# Altium schematic sheet Main.SchDoc: Connectors
size B; DocumentNumber: 1; SheetNumber: 1; SheetTotal: 1
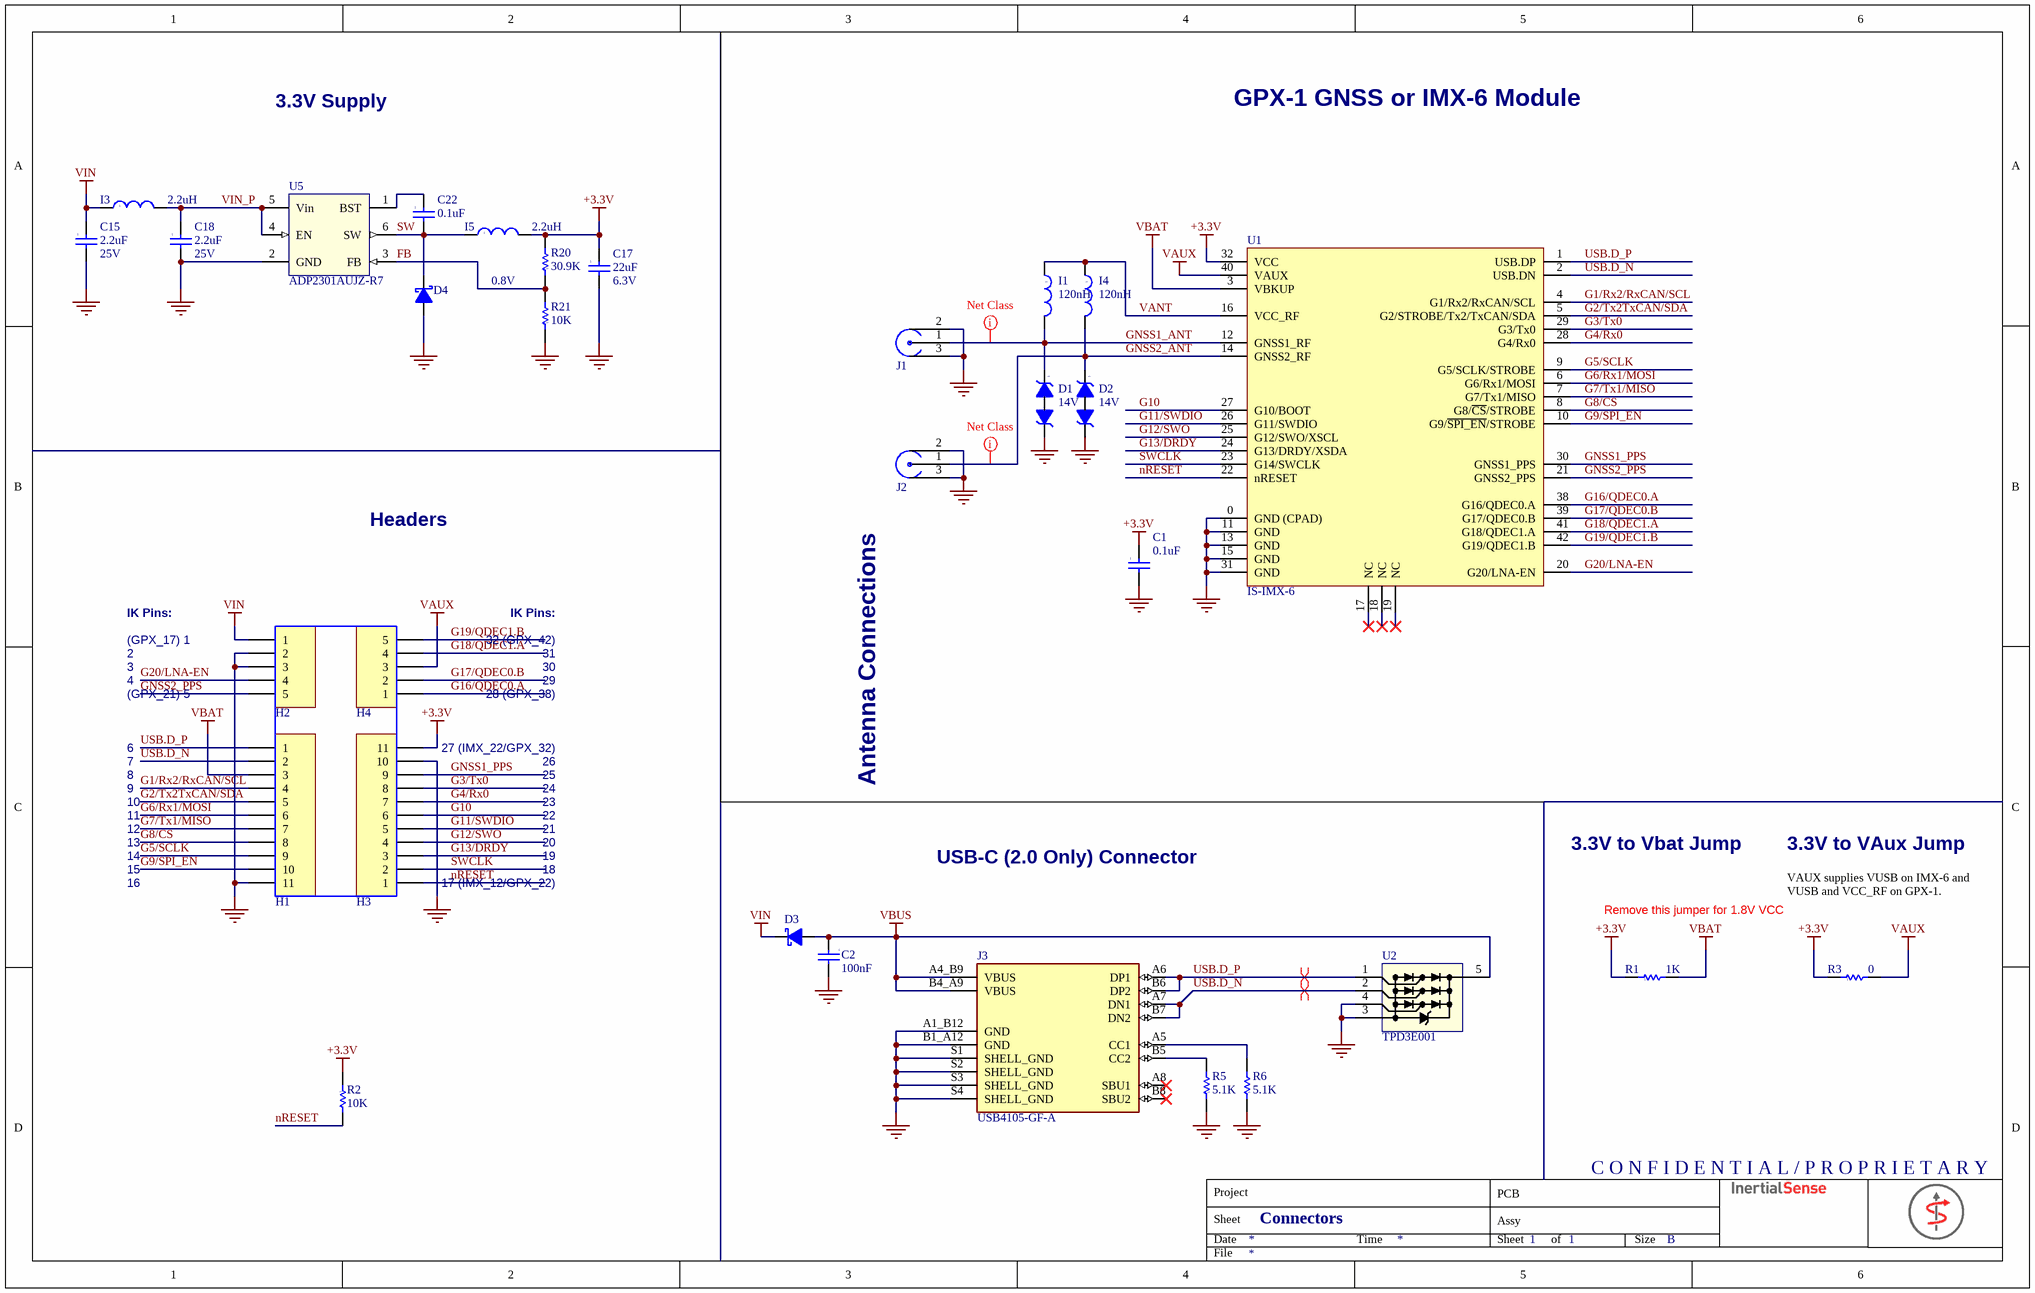
[diagram p0: Main.SchDoc]

## Parts
C1  value 0.1uF  [0402]  (hidden comment: Cap)
C2  value 100nF  [0402]  (hidden comment: Cap)
C15  value 2.2uF  Voltage Rating: 25V  [0603]  (hidden comment: Cap)
C17  value 22uF  Voltage Rating: 6.3V  [0603]  (hidden comment: Cap)
C18  value 2.2uF  Voltage Rating: 25V  [0603]  (hidden comment: Cap)
C22  value 0.1uF  [0402]  (hidden comment: Cap)
D1  Working Voltage: 14V  [R0402]  (hidden comment: Diode - Bidirectional Zener)
D2  Working Voltage: 14V  [R0402]  (hidden comment: Diode - Bidirectional Zener)
D3  Diode - Schottky  [D0603B]  (value not drawn)
D4  Diode - Schottky  [D0603B]  (value not drawn)
H1  Hdr - 11pin  [Header-.1IN-1x11]  (value not drawn)
H2  Hdr - 5pin  [Header-.1IN-1x5]  (value not drawn)
H3  Hdr - 11pin  [Header-.1IN-1x11]  (value not drawn)
H4  Hdr - 5pin  [Header-.1IN-1x5]  (value not drawn)
I1  value 120nH  [0402]  (hidden comment: Inductor)
I3  value 2.2uH  [0806]  (hidden comment: Inductor)
I4  value 120nH  [0402]  (hidden comment: Inductor)
I5  value 2.2uH  [0806]  (hidden comment: Inductor)
J1  RF - GND x 2  [RF UMC SMD]  (value not drawn)
J2  RF - GND x 2  [RF UMC SMD]  (value not drawn)
J3  USB4105-GF-A  [GCT_USB4105-GF-A]
R1  value 1K  [R0402]  (hidden comment: Res)
R2  value 10K  [R0402]  (hidden comment: Res)
R3  value 0  [R0402]  (hidden comment: Res)
R5  value 5.1K  [R0402]  (hidden comment: Res)
R6  value 5.1K  [R0402]  (hidden comment: Res)
R20  value 30.9K  [R0402]  (hidden comment: Res)
R21  value 10K  [R0402]  (hidden comment: Res)
U1  Manufacturer Part Number: IS-IMX-6  [IS-GPX-1.0]  (hidden comment: IMX)
U2  TPD3E001  [SOTFL50P160X60-5N]
U5  Manufacturer Part Number: ADP2301AUJZ-R7  [MO-178-AB]  (hidden comment: ADP2301)

## Nets
+3.3V: C1.1 C17.1 H3.11 I5.2 R1.1 R2.1 R3.1 R20.2 U1.32(VCC)
GND: C1.2 C2.2 C15.2 C17.2 C18.2 D1.2 D2.2 D4.A H1.11 H2.2 H2.3 H3.10 J1.2 J1.3 J2.2 J2.3 J3.A1_B12(GND) J3.B1_A12(GND) J3.S1(SHELL_GND) J3.S2(SHELL_GND) J3.S3(SHELL_GND) J3.S4(SHELL_GND) R5.1 R6.1 R21.1 U1.0(GND_(CPAD)) U1.11(GND) U1.13(GND) U1.15(GND) U1.31(GND) U2.3 U2.4(nc) U5.2(GND)
VAUX: H4.3 R3.2 U1.40(VAUX)
VBAT: H1.3 R1.2 U1.3(VBKUP)
VBUS: C2.1 D3.A J3.A4_B9(VBUS) J3.B4_A9(VBUS) U2.5(nc)
VIN: C15.1 D3.C H2.1 I3.1
FB: R20.1 R21.2 U5.3(FB)
G1/Rx2/RxCAN/SCL: H1.4 U1.4(G1/Rx2/RxCAN/SCL)
G2/Tx2TxCAN/SDA: H1.5 U1.5(G2/STROBE/Tx2/TxCAN/SDA)
G3/Tx0: H3.8 U1.29(G3/Tx0)
G4/Rx0: H3.7 U1.28(G4/Rx0)
G5/SCLK: H1.9 U1.9(G5/SCLK/STROBE)
G6/Rx1/MOSI: H1.6 U1.6(G6/Rx1/MOSI)
G7/Tx1/MISO: H1.7 U1.7(G7/Tx1/MISO)
G8/~{CS}: H1.8 U1.8(G8/~{CS}/STROBE)
G9/~{SPI_EN}: H1.10 U1.10(G9/~{SPI_EN}/STROBE)
G10: H3.6 U1.27(G10/BOOT)
G11/SWDIO: H3.5 U1.26(G11/SWDIO)
G12/SWO: H3.4 U1.25(G12/SWO/XSCL)
G13/DRDY: H3.3 U1.24(G13/DRDY/XSDA)
G16/QDEC0.A: H4.1 U1.38(G16/QDEC0.A)
G17/QDEC0.B: H4.2 U1.39(G17/QDEC0.B)
G18/QDEC1.A: H4.4 U1.41(G18/QDEC1.A)
G19/QDEC1.B: H4.5 U1.42(G19/QDEC1.B)
G20/LNA-EN: H2.4 U1.20(G20/LNA-EN)
GNSS1_ANT: D1.1 I1.2 J1.1 U1.12(GNSS1_RF)
GNSS1_PPS: H3.9 U1.30(GNSS1_PPS)
GNSS2_ANT: D2.1 I4.2 J2.1 U1.14(GNSS2_RF)
GNSS2_PPS: H2.5 U1.21(GNSS2_PPS)
nRESET: H3.1 R2.2 U1.22(nRESET)
SW: C22.2 D4.C I5.1 U5.6(SW)
SWCLK: H3.2 U1.23(G14/SWCLK)
USB.D_N: H1.2 J3.A7(DN1) J3.B7(DN2) U1.2(USB.DN) U2.2
USB.D_P: H1.1 J3.A6(DP1) J3.B6(DP2) U1.1(USB.DP) U2.1
VANT: I1.1 I4.1 U1.16(VCC_RF)
VIN_P: C18.1 I3.2 U5.4(EN) U5.5(Vin)
NetC22_1: C22.1 U5.1(BST)
NetJ3_A5: J3.A5(CC1) R6.2
NetJ3_B5: J3.B5(CC2) R5.2

Not connected (* = marked no-connect by the designer): J3 A8(SBU1)* B8(SBU2)*; U1 17(NC)* 18(NC)* 19(NC)*

## Layout directives
net class RF_GPS: GNSS1_ANT, GNSS2_ANT
differential pair; net class IMX_USB: USB.D_N, USB.D_P

## Notes on the sheet
- 3.3V Supply
- GPX-1 GNSS or IMX-6 Module
- 0.8V
- Headers
- Antenna Connections
- (GPX_17) 1
- IK Pins:
- 32 (GPX_42)
- (GPX_21) 5
- 2
- 3
- 4
- 28 (GPX_38)
- 29
- 30
- 31
- 6
- 7
- 8
- 27 (IMX_22/GPX_32)
- 25
- 26
- 9
- 10
- 11
- 12
- 13
- 20
- 21
- 22
- 23
- 24
- 14
- 15
- 16
- 17 (IMX_12/GPX_22)
- 18
- 19
- USB-C (2.0 Only) Connector
- 3.3V to Vbat Jump
- Remove this jumper for 1.8V VCC
- 3.3V to VAux Jump
- VAUX supplies VUSB on IMX-6 and VUSB and VCC_RF on GPX-1.
- C O N F I D E N T I A L / P R O P R I E T A R Y
- Date
- Sheet
- Project
- Time
- PCB
- Assy
- of
- Size
- B
- File

## Library data of the parts
C1 C2 = Cap: CAP CER .10UF 50V X7R 10% 0402; Manufacturer: TDK Corporation; Manufacturer Part Number: C1005X7R1H104K; Capacitance: 0.1µF; Published: 8-Jun-2000; LatestRevisionDate: 17-Jul-2002; LatestRevisionNote: Re-released for DXP Platform.; Publisher: Altium Limited; Category: Capacitors; Supplier 1: Digi-Key; Supplier Part Number 1: 445-5932-1-ND; RoHS: RoHS Compliant; Stock 1: 174080; Pricing 1: 1=0.3, 10=0.2, 100=0.08, 250=0.05752, 500=0.041, 1000=0.03 (USD); Voltage - Rated: 50V; Tolerance: ±10%; Temperature Coefficient: X7R; Mounting Type: Surface Mount, MLCC; Operating Temperature: -55°C ~ 125°C; Applications: General Purpose; Ratings: -; Package / Case: 0402 (1005 Metric); Size / Dimension: 0.039" L x 0.020" W (1.00mm x 0.50mm); Height: -; Thickness: 0.022" (0.55mm); Lead Spacing: -; Features: -; Packaging: Cut Tape (CT); Lead Style: -; ComponentLink1URL: http://www.tdk.co.jp/tefe02/e412_c.pdf; ComponentLink1Description: http://www.tdk.co.jp/tefe02/e412_c.pdf
C15 C18 = Cap: CAP CER 2.2UF 25V X6S 0603; Manufacturer: Murata; Manufacturer Part Number: GRT188C81E225KE13D; Tolerance: 10%; Published: 8-Jun-2000; LatestRevisionDate: 17-Jul-2002; LatestRevisionNote: Re-released for DXP Platform.; Publisher: Altium Limited; Category: Capacitors; Supplier 1: Digi-Key; Supplier Part Number 1: 490-12293-6-ND; Stock 1: 16854; Pricing 1: 1=0.35, 10=0.239, 100=0.1355, 500=0.09564, 1000=0.08369 (USD); Mount: Surface Mount; Case/Package: 0603; Case Code (Metric): 1608; Case Code (Imperial): 0603; Min Operating Temperature: -55°C; Max Operating Temperature: 105°C; Packaging: Tape and Reel; Capacitance: 2.2uF; Dielectric: X6S; Voltage Rating (DC): 25V; Length: 0.063inch; Width: 0.031inch; Thickness: 0.035inch; ComponentLink1URL: http://www.farnell.com/datasheets/2165949.pdf; ComponentLink1Description: http://www.farnell.com/datasheets/2165949.pdf; ComponentLink2URL: http://search.murata.co.jp/Ceramy/image/img/A01X/G101/ENG/GRT188C81E225KE13-01.pdf; ComponentLink2Description: http://search.murata.co.jp/Ceramy/image/img/A01X/G101/ENG/GRT188C81E225KE13-01.pdf
C17 = Cap: CAP CER 22UF 6.3V X6S 0603; Manufacturer: Murata; Manufacturer Part Number: GRM188C80J226ME15D; Tolerance: 20%; Published: 8-Jun-2000; LatestRevisionDate: 17-Jul-2002; LatestRevisionNote: Re-released for DXP Platform.; Publisher: Altium Limited; Category: Capacitors; Supplier 1: Digi-Key; Supplier Part Number 1: 490-10471-6-ND; Stock 1: 0; Pricing 1: 1=0.25, 10=0.168, 100=0.0955, 500=0.0674, 1000=0.05897 (USD); Mount: Surface Mount; Case/Package: 0603; Weight: 0.000222oz; Case Code (Metric): 1608; Case Code (Imperial): 0603; Min Operating Temperature: -55°C; Max Operating Temperature: 105°C; Capacitance: 22uF; Packaging: Tape and Reel; Dielectric: X6S; Termination: SMD/SMT; Voltage Rating (DC): 6.3V; Package Quantity: 4000; Length: 0.063inch; Height: 0.8mm; Width: 0.8mm; Thickness: 0.039inch; Lead Free: Lead Free; ComponentLink1URL: http://www.mouser.com/ds/2/281/c02e-2905.pdf; ComponentLink1Description: http://www.mouser.com/ds/2/281/c02e-2905.pdf; ComponentLink2URL: http://search.murata.co.jp/Ceramy/image/img/A01X/partnumbering_e_01.pdf; ComponentLink2Description: http://search.murata.co.jp/Ceramy/image/img/A01X/partnumbering_e_01.pdf
C22 = Cap: CAP CER 0.1UF 50V X7R 0402; Manufacturer: TDK; Manufacturer Part Number: CGA2B3X7R1H104K050BB; Tolerance: 10%; Published: 8-Jun-2000; LatestRevisionDate: 17-Jul-2002; LatestRevisionNote: Re-released for DXP Platform.; Publisher: Altium Limited; Category: Capacitors; Supplier 1: Digi-Key; Supplier Part Number 1: 445-6899-1-ND; Stock 1: 12402793; Pricing 1: 1=0.16000, 10=0.11700, 100=0.05500, 500=0.03858, 1000=0.03194, 2500=0.02973, 5000=0.02720 (USD); RoHS: Yes; Mount: Surface Mount; Case/Package: 0402; Weight: 2.3E-05oz; Case Code (Metric): 1005; Case Code (Imperial): 0402; Min Operating Temperature: -55°C; Max Operating Temperature: 125°C; Voltage Rating: 50V; Capacitance: 0.1uF; Packaging: Tape and Reel; Voltage Rating (DC): 50V; Dielectric: X7R; Termination: SMD/SMT; Package Quantity: 1; Composition: Ceramic; Voltage: 50V; Length: 1mm; Height: 0.5mm; Depth: 0.5mm; Width: 0.02inch; Thickness: 0.022inch; Ratings: AEC-Q200; Lead Free: Lead Free; REACH SVHC: No SVHC; ComponentLink1URL: https://datasheet.ciiva.com/16498/mlccspec-automotive-general-midvoltage-en-16498528.pdf?src-supplier=Future+Electronics; ComponentLink1Description: https://datasheet.ciiva.com/16498/mlccspec-automotive-general-midvoltage-en-16498528.pdf?src-supplier=Future+Electronics; ComponentLink2URL: https://datasheet.ciiva.com/24216/cga2b3x7r1h104k050bb-266281-24216070.pdf?src-supplier=Mouser; ComponentLink2Description: https://datasheet.ciiva.com/24216/cga2b3x7r1h104k050bb-266281-24216070.pdf?src-supplier=Mouser; ComponentLink3URL: https://datasheet.ciiva.com/7975/1788388-7975306.pdf?src-supplier=Element14; ComponentLink3Description: https://datasheet.ciiva.com/7975/1788388-7975306.pdf?src-supplier=Element14; ComponentLink4URL: https://datasheet.ciiva.com/22703/1807242-22703013.pdf?src-supplier=Element14; ComponentLink4Description: https://datasheet.ciiva.com/22703/1807242-22703013.pdf?src-supplier=Element14; ComponentLink5URL: https://datasheet.ciiva.com/22725/1735392-22725627.pdf?src-supplier=Element14; ComponentLink5Description: https://datasheet.ciiva.com/22725/1735392-22725627.pdf?src-supplier=Element14
D1 D2 = Diode - Bidirectional Zener: LITTELFUSE - PESD0402-140 - DIODE, ESD PROTECTION, 0402, FULL REEL; Clamping Voltage: 40V; Number of Bidirectional Channels: 1; Power Line Protection: No; Turn-On Delay Time: 1ns; Supplier 1: Digi-Key; Supplier Part Number 1: PESD0402-140CT-ND; Manufacturer: Littelfuse; Manufacturer Part Number: PESD0402-140; RoHS: No; Category: TVS Diodes; Stock 1: 211482; Pricing 1: 1=0.40000, 10=0.32100, 100=0.22900, 500=0.17400, 1000=0.13737, 2000=0.13279, 5000=0.12821 (USD); Mount: Surface Mount; Case/Package: 0402; Number of Pins: 2; Min Operating Temperature: -55°C; Max Operating Temperature: 125°C; Packaging: Tape and Reel; Direction: Bidirectional; Reverse Standoff Voltage: 14V; Resistor Type: Zener; Operating Supply Voltage: 14V; Lead Free: Lead Free; REACH SVHC: Unknown; ComponentLink1URL: https://datasheet.ciiva.com/58684/-58684341.pdf?src-supplier=Digi-Key; ComponentLink1Description: https://datasheet.ciiva.com/58684/-58684341.pdf?src-supplier=Digi-Key
D3 D4 = Diode - Schottky: DIODE SCHOTTKY 30V 2A 0603; Manufacturer: Vishay; Manufacturer Part Number: VSKY20301608-G4-08; Supplier 1: Digi-Key; Supplier Part Number 1: VSKY20301608-G4-08GICT-ND; Stock 1: 13064; Pricing 1: 1=0.38, 10=0.305, 25=0.2792, 100=0.2076, 250=0.1882, 500=0.15574, 1000=0.1168, 2500=0.10707 (USD); ComponentLink1URL: http://www.mouser.com/ds/2/427/vsky20301608-777242.pdf; ComponentLink1Description: http://www.mouser.com/ds/2/427/vsky20301608-777242.pdf
H1 H3 = Hdr - 11pin: 11 pin header
H2 H4 = Hdr - 5pin: 5 pin header
I1 I4 = Inductor: Inductor RF Chip Wirewound 120nH 5% 100MHz 20Q-Factor 110mA 2.66Ohm DCR 0402 Paper T/R; Manufacturer: Murata; Manufacturer Part Number: LQW15ANR12J00D; Core Material: Air,Ferrite; DC Resistance (DCR): 2.66R; Shielding: Unshielded; Self Resonant Frequency: 1GHz; ComponentLink1URL: http://search.murata.co.jp/Ceramy/image/img/PDF/ENG/L0075S0083LQG15HS.pdf; ComponentLink1Description: http://search.murata.co.jp/Ceramy/image/img/PDF/ENG/L0075S0083LQG15HS.pdf; Supplier 1: Digi-Key; Supplier Part Number 1: 490-4091-1-ND; RoHS: Yes; Category: Fixed Inductors; Stock 1: 2053; Pricing 1: 1=0.15000, 10=0.13500, 25=0.12000, 50=0.10200, 100=0.09000, 250=0.08252, 500=0.07500, 1000=0.06300, 2500=0.05400 (USD); Mount: Surface Mount; Case/Package: 0402; Number of Pins: 2; Case Code (Imperial): 0402; Weight: 2.8E-05oz; Case Code (Metric): 1005; Min Operating Temperature: -55°C; Max Operating Temperature: 125°C; Tolerance: 5%; Inductance: 120nH; Max DC Current: 110mA; Packaging: Tape and Reel; Inductance Tolerance: 5%; Package Quantity: 10000; Current Rating: 110mA; Test Frequency: 100MHz; Termination: SMD/SMT; DC Current: 110mA; Length: 1mm; Width: 0.02inch; Height: 0.5mm; Depth: 0.6mm; Radiation Hardening: No; Lead Free: Lead Free; Military Standard: Not; REACH SVHC: No SVHC; ComponentLink2URL: https://datasheet.ciiva.com/11799/0900766b8090d800-11799096.pdf?src-supplier=RSComponents; ComponentLink2Description: https://datasheet.ciiva.com/11799/0900766b8090d800-11799096.pdf?src-supplier=RSComponents; ComponentLink3URL: https://datasheet.ciiva.com/1042/l0075s0080lqw15a-00-1042180.pdf?src-supplier=Digi-Key; ComponentLink3Description: https://datasheet.ciiva.com/1042/l0075s0080lqw15a-00-1042180.pdf?src-supplier=Digi-Key; ComponentLink4URL: https://datasheet.ciiva.com/1042/l0075s0080lqw15a-00-1042181.pdf?src-supplier=Digi-Key; ComponentLink4Description: https://datasheet.ciiva.com/1042/l0075s0080lqw15a-00-1042181.pdf?src-supplier=Digi-Key; ComponentLink5URL: https://datasheet.ciiva.com/1042/l0075s0080lqw15a-00-1042182.pdf?src-supplier=Digi-Key; ComponentLink5Description: https://datasheet.ciiva.com/1042/l0075s0080lqw15a-00-1042182.pdf?src-supplier=Digi-Key; ComponentLink6URL: https://datasheet.ciiva.com/16207/l0075s0080lqw15a-00-16207819.pdf?src-supplier=Future+Electronics; ComponentLink6Description: https://datasheet.ciiva.com/16207/l0075s0080lqw15a-00-16207819.pdf?src-supplier=Future+Electronics; ComponentLink7URL: https://datasheet.ciiva.com/8506/l0075s0080lqw15a-00-8506030.pdf?src-supplier=Avnet; ComponentLink7Description: https://datasheet.ciiva.com/8506/l0075s0080lqw15a-00-8506030.pdf?src-supplier=Avnet
I3 I5 = Inductor: FIXED IND 2.2UH 1.2A 110 MOHM; Manufacturer: TDK; Manufacturer Part Number: MLP2016H2R2MT0S1; Core Material: Ferrite; Tolerance: 20%; Shielding: Unshielded; DC Resistance (DCR): 137.5mR; Test Frequency: 2MHz; Supplier 1: Digi-Key; Supplier Part Number 1: 445-15724-6-ND; Stock 1: 14048; Pricing 1: 1=0.38, 10=0.335, 100=0.2302, 500=0.19674, 1000=0.1507 (USD); Mount: Surface Mount; Case/Package: 0806; Case Code (Metric): 2016; Case Code (Imperial): 0806; Min Operating Temperature: -40°C; Max Operating Temperature: 125°C; Package Quantity: 3000; Packaging: Tape and Reel; Current Rating: 1.2A; Inductance: 2.2uh; Length: 0.079inch; Width: 0.063inch; Height - Seated (Max): 0.039inch; Lead Free: Lead Free; ComponentLink1URL: https://datasheet.ciiva.com/29697/inductor-commercial-power-mlp-en-29697725.pdf; ComponentLink1Description: https://datasheet.ciiva.com/29697/inductor-commercial-power-mlp-en-29697725.pdf; ComponentLink2URL: https://datasheet.ciiva.com/29697/inductor-commercial-power-mlp-en-29697726.pdf; ComponentLink2Description: https://datasheet.ciiva.com/29697/inductor-commercial-power-mlp-en-29697726.pdf
J1 J2 = RF - GND x 2: CONN UMC RCPT STR 50 OHM SMD; Manufacturer: Emerson Network Power Connectivity Johnson; Manufacturer Part Number: 128-0711-201; Connector Style: Ultra Miniature Coaxial; Connector Type: Receptacle, Male Pins; Contact Termination: Solder; Impedance: 50 Ohm; Frequency - Max: 6GHz; Body Finish: Gold; Voltage Rating: 200V; Supplier 1: Digi-Key; Supplier Part Number 1: J983CT-ND; RoHS: RoHS Compliant; Category: Connectors, Interconnects; Stock 1: 1514; Pricing 1: 1=0.93, 10=0.832, 50=0.784, 100=0.672, 250=0.576, 500=0.544, 750=0.48, 1000=0.448 (USD); Packaging: Cut Tape (CT); Shield Termination: Solder; Mounting Type: Surface Mount; Cable Group: -; Fastening Type: Snap-On; Features: -; Housing Color: Gold; Ingress Protection: -; Body Material: -; Center Contact Material: -; Center Contact Plating: Gold; Dielectric Material: -; Operating Temperature: -40°C ~ 90°C; ComponentLink1URL: http://media.digikey.com/pdf/Data%20Sheets/Emerson%20PDFs/UMC%20Product%20Catalog.pdf; ComponentLink1Description: http://media.digikey.com/pdf/Data%20Sheets/Emerson%20PDFs/UMC%20Product%20Catalog.pdf
J3 = USB4105-GF-A: USB-C (USB TYPE-C) USB 2.0 Receptacle Connector 24 (16+8 Dummy) Position Surface Mount, Right Angle; Through Hole; Manufacturer: GCT; Value: *; Availability: Unavailable; Price: None; Package: None; Manufacturer Part Number: USB4105-GF-A; Supplier Part Number 1: 2073-USB4105-GF-ACT-ND; Supplier 1: DigiKey
R1 = Res: 1 kOhms 1/16W Chip Resistor 0402 (1005 Metric) Moisture Resistant Thick Film; Manufacturer: Yageo; Manufacturer Part Number: RC0402FR-071KL; Tolerance: 1%; Temperature Coefficient: 100ppm/°C; Power Rating: 62.5mW; Voltage Rating: 50V; Max Power Dissipation: 63mW; Supplier: Digi-Key; Supplier Part Number: 311-1.00KLRTR-ND; RoHS: Yes; Category: Chip SMD Resistors; Stock: 29757748; Pricing: 10000=0.00261, 20000=0.00231, 30000=0.00216, 50000=0.00199, 100000=0.00179 (USD); Case/Package: 0402; Pins: 2; Case Code (Imperial): 0402; Case Code (Metric): 1005; Min Operating Temperature: -55°C; Max Operating Temperature: 155°C; Resistor Type: Thick Film; Packaging: Tape and Reel; Voltage Rating (DC): 50V; Termination: SMD/SMT; Features: Moisture Resistant; Series: RC; Number of Terminations: 2; Resistance Tolerance: 1%; Construction: Rectangular; Technology: THICK FILM; Length: 1mm; Width: 0.5mm; Height: 0.32mm; Depth: 0.5mm; RoHS Compliant: Yes; Reach SVHC Compliant: No; Military Standard: Not; Lead Free: Lead Free; ComponentLink1URL: https://datasheet.ciiva.com/11819/0900766b80c66297-11819477.pdf?src-supplier=Rs; ComponentLink1Description: https://datasheet.ciiva.com/11819/0900766b80c66297-11819477.pdf?src-supplier=Rs; ComponentLink2URL: https://datasheet.ciiva.com/7983/1018594-7983502.pdf?src-supplier=Element14; ComponentLink2Description: https://datasheet.ciiva.com/7983/1018594-7983502.pdf?src-supplier=Element14; ComponentLink3URL: https://datasheet.ciiva.com/22747/1018594-22747513.pdf?src-supplier=Element14; ComponentLink3Description: https://datasheet.ciiva.com/22747/1018594-22747513.pdf?src-supplier=Element14; ComponentLink4URL: https://datasheet.ciiva.com/12666/pyu-rc0402-51-rohs-l-6-r-12666741.pdf?src-supplier=Mouser; ComponentLink4Description: https://datasheet.ciiva.com/12666/pyu-rc0402-51-rohs-l-6-r-12666741.pdf?src-supplier=Mouser; ComponentLink5URL: https://datasheet.ciiva.com/7849/1018594-7849869.pdf?src-supplier=Element14; ComponentLink5Description: https://datasheet.ciiva.com/7849/1018594-7849869.pdf?src-supplier=Element14; ComponentLink6URL: https://datasheet.ciiva.com/7849/1018594-7849871.pdf?src-supplier=Element14; ComponentLink6Description: https://datasheet.ciiva.com/7849/1018594-7849871.pdf?src-supplier=Element14; ComponentLink7URL: https://datasheet.ciiva.com/17063/pyu-rc0402-51-rohs-l-6-r-17063193.pdf?src-supplier=Future+Electronics; ComponentLink7Description: https://datasheet.ciiva.com/17063/pyu-rc0402-51-rohs-l-6-r-17063193.pdf?src-supplier=Future+Electronics
R2 = Res: 10 kOhms 1/16W Chip Resistor 0402 (1005 Metric) Moisture Resistant Thick Film; Manufacturer: Stackpole Electronics; Manufacturer Part Number: RMCF0402FT10K0; Tolerance: 1%; Temperature Coefficient: 100ppm/°C; Power Rating: 62.5mW; Voltage Rating: 50V; Max Power Dissipation: 63mW; Supplier: Digi-Key; Supplier Part Number: RMCF0402FT10K0TR-ND; RoHS: Yes; Category: Chip SMD Resistors; Stock: 29757748; Pricing: 10000=0.00261, 20000=0.00231, 30000=0.00216, 50000=0.00199, 100000=0.00179 (USD); Case/Package: 0402; Pins: 2; Case Code (Imperial): 0402; Case Code (Metric): 1005; Min Operating Temperature: -55°C; Max Operating Temperature: 155°C; Resistor Type: Thick Film; Packaging: Tape and Reel; Voltage Rating (DC): 50V; Termination: SMD/SMT; Features: Moisture Resistant; Series: RC; Number of Terminations: 2; Resistance Tolerance: 1%; Construction: Rectangular; Technology: THICK FILM; Length: 1mm; Width: 0.5mm; Height: 0.32mm; Depth: 0.5mm; RoHS Compliant: Yes; Reach SVHC Compliant: No; Military Standard: Not; Lead Free: Lead Free; ComponentLink1URL: https://datasheet.ciiva.com/11819/0900766b80c66297-11819477.pdf?src-supplier=Rs; ComponentLink1Description: https://datasheet.ciiva.com/11819/0900766b80c66297-11819477.pdf?src-supplier=Rs; ComponentLink2URL: https://datasheet.ciiva.com/7983/1018594-7983502.pdf?src-supplier=Element14; ComponentLink2Description: https://datasheet.ciiva.com/7983/1018594-7983502.pdf?src-supplier=Element14; ComponentLink3URL: https://datasheet.ciiva.com/22747/1018594-22747513.pdf?src-supplier=Element14; ComponentLink3Description: https://datasheet.ciiva.com/22747/1018594-22747513.pdf?src-supplier=Element14; ComponentLink4URL: https://datasheet.ciiva.com/12666/pyu-rc0402-51-rohs-l-6-r-12666741.pdf?src-supplier=Mouser; ComponentLink4Description: https://datasheet.ciiva.com/12666/pyu-rc0402-51-rohs-l-6-r-12666741.pdf?src-supplier=Mouser; ComponentLink5URL: https://datasheet.ciiva.com/7849/1018594-7849869.pdf?src-supplier=Element14; ComponentLink5Description: https://datasheet.ciiva.com/7849/1018594-7849869.pdf?src-supplier=Element14; ComponentLink6URL: https://datasheet.ciiva.com/7849/1018594-7849871.pdf?src-supplier=Element14; ComponentLink6Description: https://datasheet.ciiva.com/7849/1018594-7849871.pdf?src-supplier=Element14; ComponentLink7URL: https://datasheet.ciiva.com/17063/pyu-rc0402-51-rohs-l-6-r-17063193.pdf?src-supplier=Future+Electronics; ComponentLink7Description: https://datasheet.ciiva.com/17063/pyu-rc0402-51-rohs-l-6-r-17063193.pdf?src-supplier=Future+Electronics
R3 = Res: 0 Ohms 1/16W Chip Resistor 0402 (1005 Metric) Moisture Resistant Thick Film; Manufacturer: Yageo; Manufacturer Part Number: RC0402JR-070RL; Tolerance: 1%; Temperature Coefficient: 100ppm/°C; Power Rating: 62.5mW; Voltage Rating: 50V; Max Power Dissipation: 63mW; Supplier: Digi-Key; Supplier Part Number: 311-0.0JRCT-ND; RoHS: Yes; Category: Chip SMD Resistors; Stock: 29757748; Pricing: 10000=0.00261, 20000=0.00231, 30000=0.00216, 50000=0.00199, 100000=0.00179 (USD); Case/Package: 0402; Pins: 2; Case Code (Imperial): 0402; Case Code (Metric): 1005; Min Operating Temperature: -55°C; Max Operating Temperature: 155°C; Resistor Type: Thick Film; Packaging: Tape and Reel; Voltage Rating (DC): 50V; Termination: SMD/SMT; Features: Moisture Resistant; Series: RC; Number of Terminations: 2; Resistance Tolerance: 1%; Construction: Rectangular; Technology: THICK FILM; Length: 1mm; Width: 0.5mm; Height: 0.32mm; Depth: 0.5mm; RoHS Compliant: Yes; Reach SVHC Compliant: No; Military Standard: Not; Lead Free: Lead Free; ComponentLink1URL: https://datasheet.ciiva.com/11819/0900766b80c66297-11819477.pdf?src-supplier=Rs; ComponentLink1Description: https://datasheet.ciiva.com/11819/0900766b80c66297-11819477.pdf?src-supplier=Rs; ComponentLink2URL: https://datasheet.ciiva.com/7983/1018594-7983502.pdf?src-supplier=Element14; ComponentLink2Description: https://datasheet.ciiva.com/7983/1018594-7983502.pdf?src-supplier=Element14; ComponentLink3URL: https://datasheet.ciiva.com/22747/1018594-22747513.pdf?src-supplier=Element14; ComponentLink3Description: https://datasheet.ciiva.com/22747/1018594-22747513.pdf?src-supplier=Element14; ComponentLink4URL: https://datasheet.ciiva.com/12666/pyu-rc0402-51-rohs-l-6-r-12666741.pdf?src-supplier=Mouser; ComponentLink4Description: https://datasheet.ciiva.com/12666/pyu-rc0402-51-rohs-l-6-r-12666741.pdf?src-supplier=Mouser; ComponentLink5URL: https://datasheet.ciiva.com/7849/1018594-7849869.pdf?src-supplier=Element14; ComponentLink5Description: https://datasheet.ciiva.com/7849/1018594-7849869.pdf?src-supplier=Element14; ComponentLink6URL: https://datasheet.ciiva.com/7849/1018594-7849871.pdf?src-supplier=Element14; ComponentLink6Description: https://datasheet.ciiva.com/7849/1018594-7849871.pdf?src-supplier=Element14; ComponentLink7URL: https://datasheet.ciiva.com/17063/pyu-rc0402-51-rohs-l-6-r-17063193.pdf?src-supplier=Future+Electronics; ComponentLink7Description: https://datasheet.ciiva.com/17063/pyu-rc0402-51-rohs-l-6-r-17063193.pdf?src-supplier=Future+Electronics
R5 R6 = Res: Res Thick Film 1.0 x 0.5 mm 5.1K Ohm 1% 0.063W(1/16W) 100ppm/ C Molded SMD Paper T/R; Manufacturer: Yageo; Manufacturer Part Number: RC0402FR-075K1L; Power Rating: 63mW; Temperature Coefficient: 100ppm/°C; Voltage Rating: 50V; Supplier 1: Digi-Key; Supplier Part Number 1: 311-5.10KLRCT-ND; RoHS: Yes; Category: Chip SMD Resistors; Stock: 1485978; Pricing: 1=0.10000, 10=0.01500, 100=0.00730, 1000=0.00417, 2500=0.00342, 5000=0.00297 (USD); Case/Package: 0402; Case Code (Metric): 1005; Case Code (Imperial): 0402; Min Operating Temperature: -55°C; Max Operating Temperature: 155°C; Tolerance: 1%; Technology: THICK FILM; Packaging: Tape and Reel; Package Quantity: 1; Resistor Type: Thick Film; Number of Terminations: 2; Termination: SMD/SMT; Max Power Dissipation: 63mW; Voltage Rating (DC): 50V; Working Voltage: 50V; Features: Moisture Resistant; Series: RC; Resistance Tolerance: 1%; Construction: Rectangular; Length: 1mm; Width: 0.02inch; Height: 0.016inch; Depth: 0.5mm; RoHS Compliant: Yes; Military Standard: Not; Lead Free: Lead Free; Reach SVHC Compliant: Unknown; ComponentLink1URL: https://datasheet.ciiva.com/7983/1018594-7983519.pdf?src-supplier=Element14; ComponentLink1Description: https://datasheet.ciiva.com/7983/1018594-7983519.pdf?src-supplier=Element14; ComponentLink2URL: https://datasheet.ciiva.com/46394/1018594-46394936.pdf?src-supplier=Element14; ComponentLink2Description: https://datasheet.ciiva.com/46394/1018594-46394936.pdf?src-supplier=Element14; ComponentLink3URL: https://datasheet.ciiva.com/2453/pyu-r-int-thick-7-2453401.pdf?src-supplier=Digi-Key; ComponentLink3Description: https://datasheet.ciiva.com/2453/pyu-r-int-thick-7-2453401.pdf?src-supplier=Digi-Key; ComponentLink4URL: https://datasheet.ciiva.com/2453/pyu-r-int-thick-7-2453402.pdf?src-supplier=Digi-Key; ComponentLink4Description: https://datasheet.ciiva.com/2453/pyu-r-int-thick-7-2453402.pdf?src-supplier=Digi-Key; ComponentLink5URL: https://datasheet.ciiva.com/2453/pyu-r-int-thick-7-2453400.pdf?src-supplier=Digi-Key; ComponentLink5Description: https://datasheet.ciiva.com/2453/pyu-r-int-thick-7-2453400.pdf?src-supplier=Digi-Key; ComponentLink6URL: https://datasheet.ciiva.com/12558/pyu-rc0402-51-rohs-l-6-r-8721-12558460.pdf?src-supplier=Mouser; ComponentLink6Description: https://datasheet.ciiva.com/12558/pyu-rc0402-51-rohs-l-6-r-8721-12558460.pdf?src-supplier=Mouser; ComponentLink7URL: https://datasheet.ciiva.com/16744/pyu-rc0402-51-rohs-l-6-r-16744283.pdf?src-supplier=Future+Electronics; ComponentLink7Description: https://datasheet.ciiva.com/16744/pyu-rc0402-51-rohs-l-6-r-16744283.pdf?src-supplier=Future+Electronics; ComponentLink8URL: https://datasheet.ciiva.com/15189/getdatasheetpartid-323636-15189493.pdf?src-supplier=Verical; ComponentLink8Description: https://datasheet.ciiva.com/15189/getdatasheetpartid-323636-15189493.pdf?src-supplier=Verical
R20 = Res: RES TF 30.9K OHM 1% 1/16W 0402; Manufacturer: Stackpole Electronics Inc; Manufacturer Part Number: RMCF0402FT30K9; Power (Watts): 0.063W, 1/16W; Temperature Coefficient: ±100ppm/°C; LatestRevisionDate: 2-Dec-2009; Supplier 1: Digi-Key; Supplier Part Number 1: RMCF0402FT30K9CT-ND; RoHS: RoHS Compliant; Category: Resistors; Stock 1: 6328; Pricing 1: 1=0.04, 10=0.025, 50=0.0138, 100=0.0105, 250=0.0078, 500=0.00576, 1000=0.00384 (USD); Resistance (Ohms): 30.9K; Composition: Thick Film; Features: -; Tolerance: ±1%; Size / Dimension: 0.039" L x 0.020" W (1.00mm x 0.50mm); Height: 0.016" (0.40mm); Number of Terminations: 2; Packaging: Cut Tape (CT); Package / Case: 0402 (1005 Metric); ComponentLink1URL: http://www.seielect.com/Catalog/SEI-RMCF.pdf; ComponentLink1Description: http://www.seielect.com/Catalog/SEI-RMCF.pdf
R21 = Res: RES 10.0K OHM 1/16W 1% 0402 SMD; Manufacturer: Yageo; Manufacturer Part Number: RC0402FR-0710KL; Power (Watts): 0.063W, 1/16W; Temperature Coefficient: ±100ppm/°C; LatestRevisionDate: 2-Dec-2009; Supplier 1: Digi-Key; Supplier Part Number 1: 311-10.0KLRCT-ND; RoHS: RoHS Compliant; Category: Resistors; Stock 1: 5597980; Pricing 1: 10=0.014, 50=0.0104, 100=0.0079, 250=0.00584, 500=0.00432, 1000=0.00288 (USD); Resistance (Ohms): 10K; Composition: Thick Film; Features: -; Tolerance: ±1%; Size / Dimension: 0.039" L x 0.020" W (1.00mm x 0.50mm); Height: 0.014" (0.35mm); Number of Terminations: 2; Packaging: Cut Tape (CT); Package / Case: 0402 (1005 Metric); ComponentLink1URL: http://www.yageo.com/documents/recent/PYu-RC0402_51_RoHS_L_6.pdf; ComponentLink1Description: http://www.yageo.com/documents/recent/PYu-RC0402_51_RoHS_L_6.pdf
U1 = IS-GPX-1.0: Inertial Sense IMX; Manufacturer: Inertial Sense; Supplier 1: Inertial Sense; Supplier Part Number 1: IS-IMX-6
U2 = TPD3E001: TVS DIODE 5.5V SOT5; Manufacturer: Texas Instruments; Manufacturer Part Number: TPD3E001DRLR; Direction: Unidirectional; Number of Channels: 3; Min Supply Voltage: 900mV; Capacitance: 1.5pF; Min Breakdown Voltage: 11V; Peak Pulse Power: 90W; Power Line Protection: Yes; Clamping Voltage: 105.5V; Leakage Current: 1nA; Max Supply Current: 100nA; Interface: USB; Supplier 1: Digi-Key; Supplier Part Number 1: TPD3E001; Stock 1: 81393; Pricing 1: 1=0.53, 10=0.454, 100=0.3392, 500=0.26648, 1000=0.20592 (USD); Case/Package: SOT; Number of Pins: 5; Weight: 9.9E-05oz; Min Operating Temperature: -40°C; Max Operating Temperature: 85°C; Max Supply Voltage: 5.5V; Packaging: Tape and Reel; Max Supply Voltage (DC): 5.5V; Min Supply Voltage (DC): 900mV; Package Quantity: 1; Number of Bidirectional Channels: 3; Reverse Standoff Voltage: 5.5V; Breakdown Voltage: 11V; Termination: SMD/SMT; Nominal Supply Current: 1nA; Length: 1.6mm; Height: 0.55mm; Width: 1.2mm; Depth: 1.2mm; Radiation Hardening: No; REACH SVHC: No SVHC; Lead Free: Lead Free
U5 = ADP2301: IC BUCK ADJ 1.2A 6TSOT; Manufacturer: Analog Devices Inc; Output Type: Adjustable; Number of Outputs: 1; Voltage - Output: 0.8 V ~ 17 V; Voltage - Input: 3 V ~ 20 V; PWM Type: Current Mode; Frequency - Switching: 1.4MHz; Synchronous Rectifier: No; Supplier 1: Digi-Key; RoHS: RoHS Compliant; Category: Integrated Circuits (ICs); Stock 1: 6699; Pricing 1: 1=3.06, 25=2.4992, 100=2.244, 250=2.04, 500=1.785, 1000=1.53 (USD); Type: Step-Down (Buck); Current - Output: 1.2A; Operating Temperature: -40°C ~ 125°C; Mounting Type: Surface Mount; Package / Case: SOT-23-6 Thin, TSOT-23-6; Packaging: Cut Tape (CT); Supplier Device Package: TSOT-6; ComponentLink1URL: http://www.analog.com/static/imported-files/data_sheets/ADP2300_2301.pdf; ComponentLink1Description: http://www.analog.com/static/imported-files/data_sheets/ADP2300_2301.pdf; Supplier Part Number 1: ADP2301AUJZ-R7CT-ND